# EasyEDA schematic SCH_Manip_2024-04-15.json
TITLE: Sheet_1; REV: 1.0; Date: 2024-04-04; Sheet: 1/1; Drawn By: tamir3; Company: Your Company
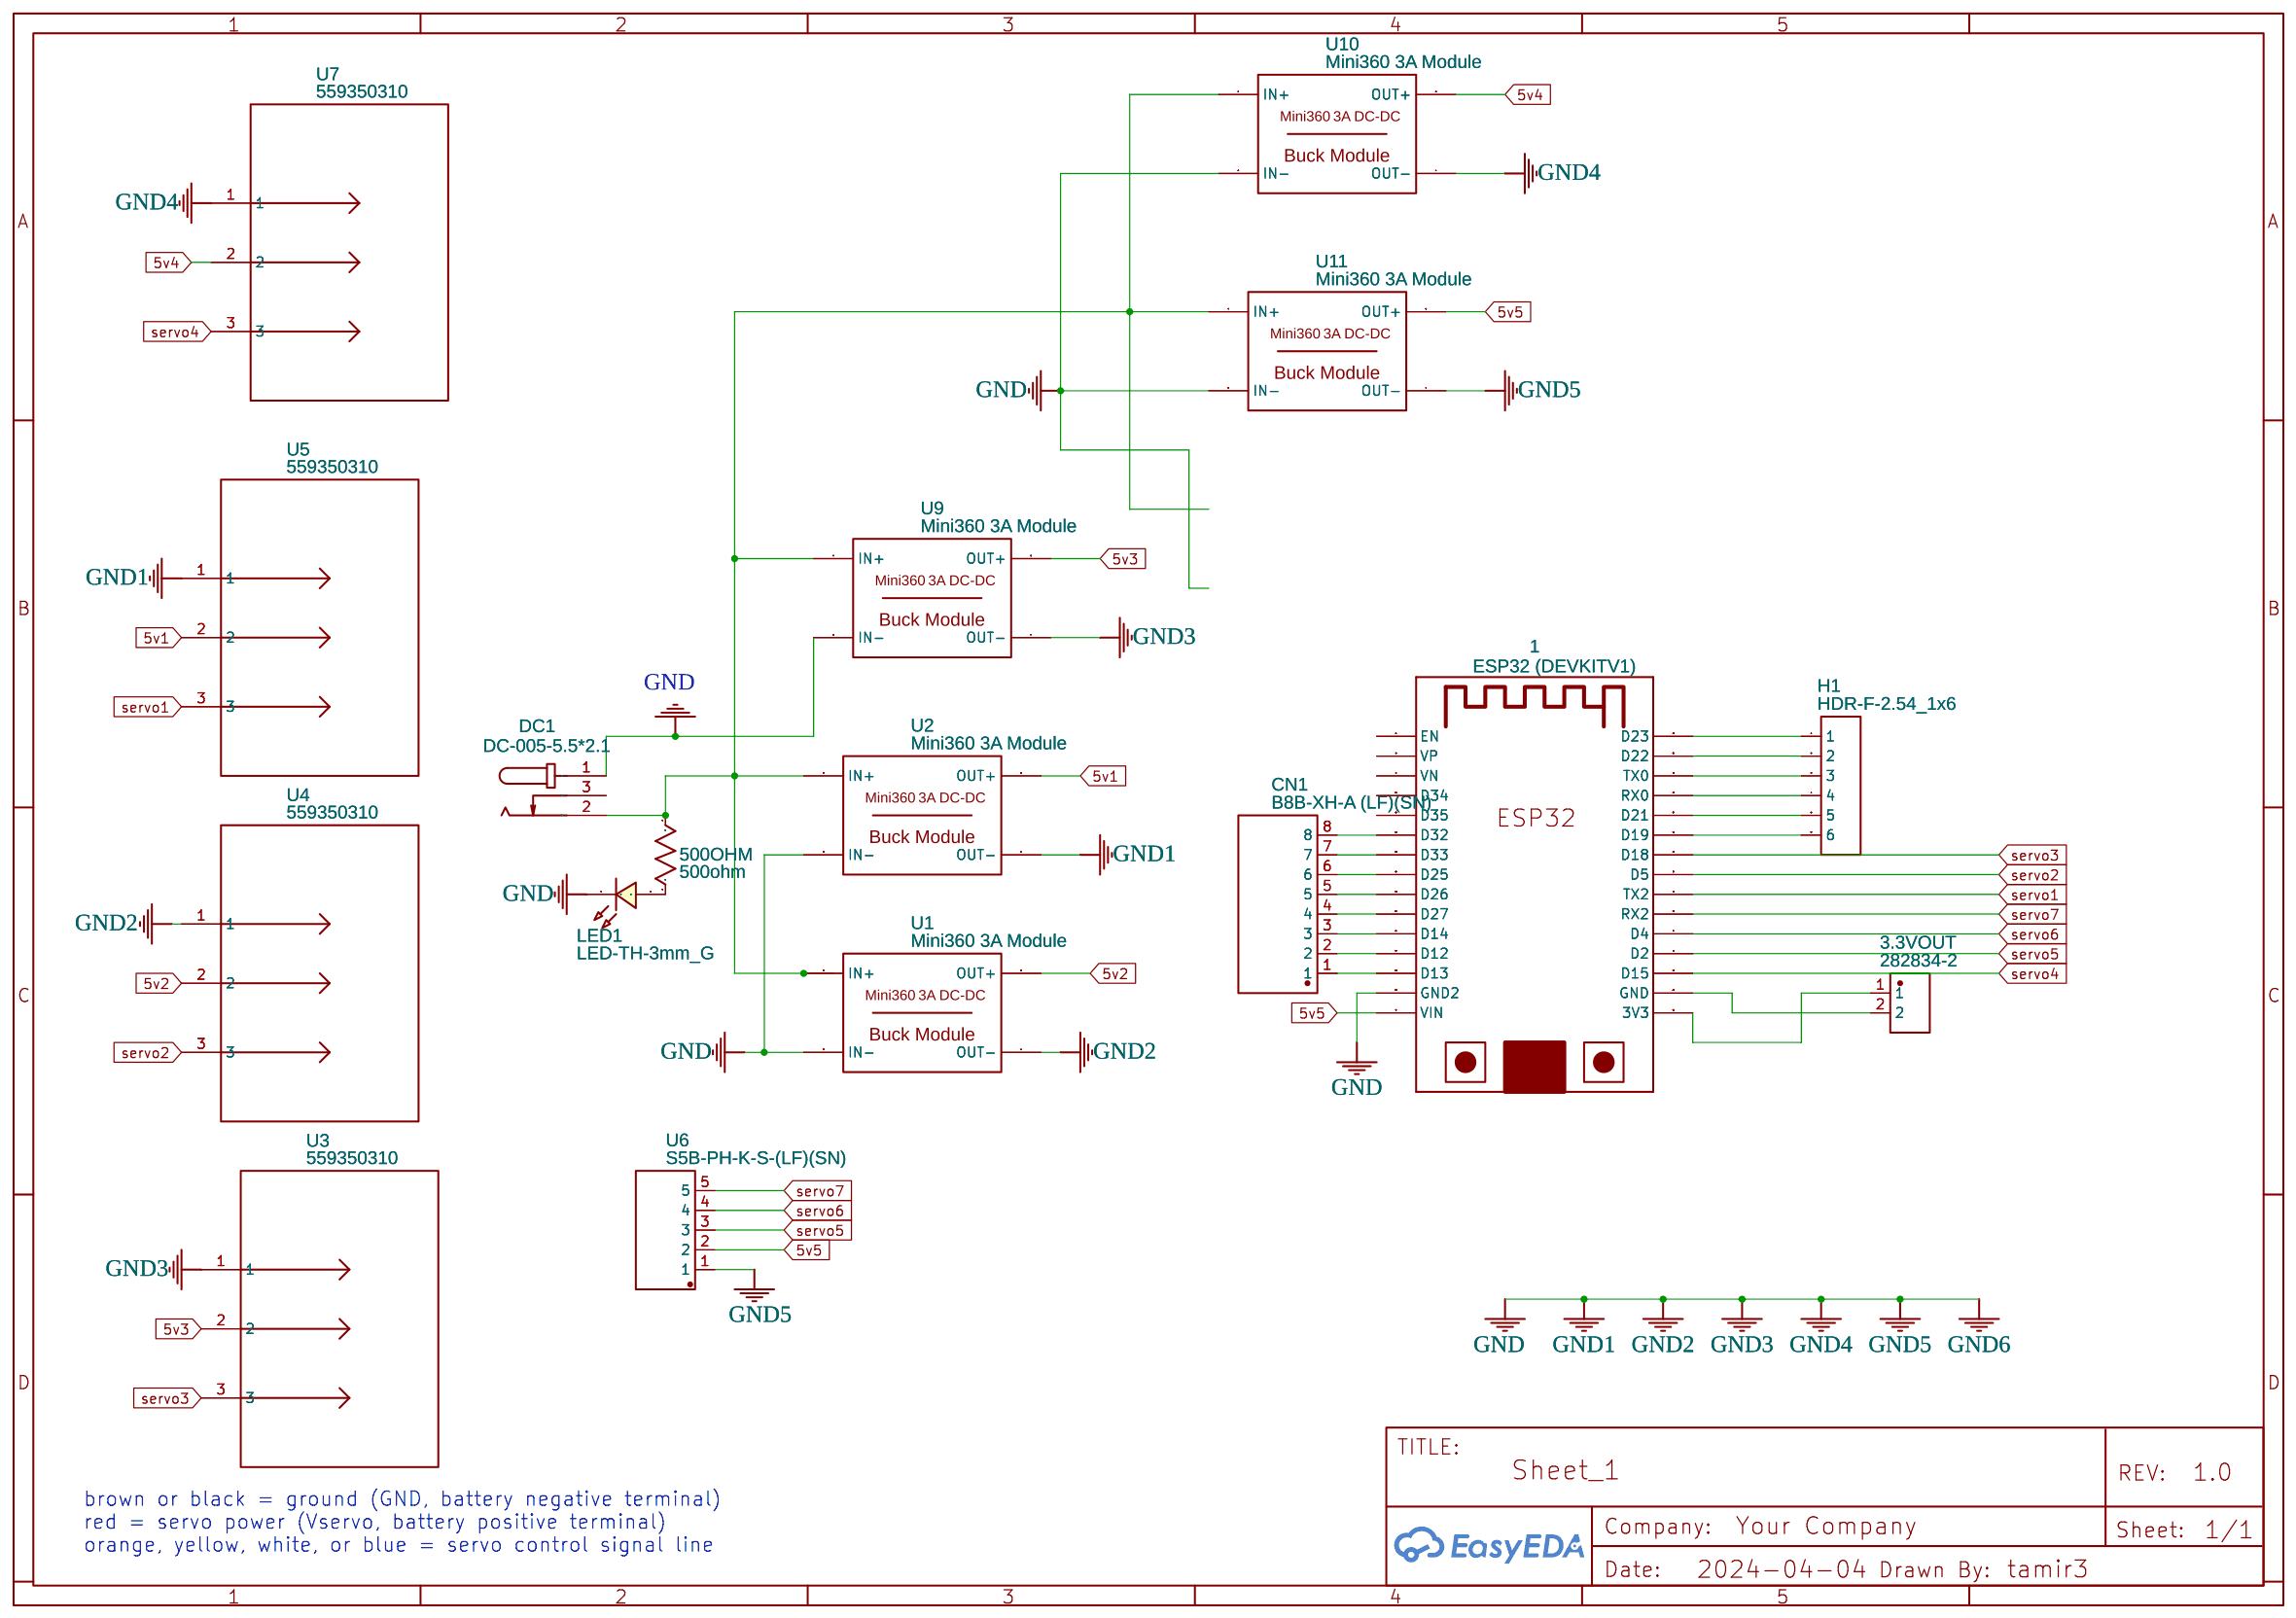
[diagram p0: schematic sheet]

## Parts
1  ESP32 (DEVKITV1)  [ESP32-DEVKITV1_ESP32-DEVKITV1]
3.3VOUT  282834-2  [CONN-TH_2P-P2.54_282834-2]
500OHM  500ohm  [R_AXIAL-0.6]
CN1  B8B-XH-A (LF)(SN)  [CONN-TH_B8B-XH-A-LF-SN]
DC1  DC-005-5.5*2.1  [DC-IN-TH_DC-005-2]
H1  HDR-F-2.54_1x6  [HDR-F-2.54_1X6]
LED1  LED-TH-3mm_G  [LED-TH_BD3.0_GREEN]
U1  Mini360 3A Module  [MINI360 BUCK CONVERTER]
U2  Mini360 3A Module  [MINI360 BUCK CONVERTER]
U3  559350310  [CONN-TH_559350310]
U4  559350310  [CONN-TH_559350310]
U5  559350310  [CONN-TH_559350310]
U6  S5B-PH-K-S-(LF)(SN)  [CONN-TH_S5B-PH-K-S-LF-SN]
U7  559350310  [CONN-TH_559350310]
U9  Mini360 3A Module  [MINI360 BUCK CONVERTER]
U10  Mini360 3A Module  [MINI360 BUCK CONVERTER]
U11  Mini360 3A Module  [MINI360 BUCK CONVERTER]

## Library data of the parts
1 = ESP32-DEVKIT-V1-30PIN: Contributor: rully.anggraini99
3.3VOUT = 282834-2: Contributor: lcsc; Supplier: LCSC; Supplier Part: C592983; Manufacturer: TE Connectivity(泰科电子); JLCPCB Part Class: Extended Part
500OHM = R_AXIAL-0.6_US: Contributor: LCEDA_Lib
CN1 = B8B-XH-A (LF)(SN): Contributor: LCSC; Supplier: LCSC; Supplier Part: C157972; Manufacturer: JST; Manufacturer Part: B8B-XH-A(LF)(SN); JLCPCB Part Class: Extended Part
DC1 = DC-005-5.5*2.1: Contributor: lcsc; Supplier: LCSC; Supplier Part: C9900017044; Manufacturer: null; JLCPCB Part Class: Extended Part
H1 = HDR-F-2.54_1x6: Supplier Part: C40877; Supplier: LCSC; Contributor: LCEDA_Lib
LED1 = LED-TH-3mm_G: Manufacturer: EVERLIGHT(台湾亿光); Manufacturer Part: 204-10SYGD/S530-E3; Supplier Part: C85161; Contributor: LCEDA_Lib
U1 U2 U9-U11 = Mini360 3A Module: Contributor: Joey Uson
U3-U5 U7 = 559350310: Contributor: LCSC; Supplier: LCSC; Supplier Part: C564109; Manufacturer: MOLEX; JLCPCB Part Class: Extended Part
U6 = S5B-PH-K-S-(LF)(SN): Contributor: LCSC; Supplier: LCSC; Supplier Part: C157923; Manufacturer: JST; Manufacturer Part: S5B-PH-K-S(LF)(SN); JLCPCB Part Class: Extended Part

## Nets
5v1: U2.3(OUT+) U5.2
5v2: U1.3(OUT+) U4.2
5v3: U3.2 U9.3(OUT+)
5v4: U7.2 U10.3(OUT+)
5v5: 1.VIN U6.2 U11.3(OUT+)
GND: 1.GND2 DC1.1 LED1.2 U1.2(IN-) U1.4(OUT-) U2.2(IN-) U2.4(OUT-) U3.1 U4.1 U5.1 U6.1 U7.1 U9.2(IN-) U9.4(OUT-) U10.2(IN-) U10.4(OUT-) U11.2(IN-) U11.4(OUT-)
servo1: 1.TX2 U5.3
servo2: 1.D5 U4.3
servo3: 1.D18 U3.3
servo4: 1.D15 U7.3
servo5: 1.D2 U6.3
servo6: 1.D4 U6.4
servo7: 1.RX2 U6.5
Net-(1-3V3): 1.3V3 3.3VOUT.1
Net-(1-D12): 1.D12 CN1.2
Net-(1-D13): 1.D13 CN1.1
Net-(1-D14): 1.D14 CN1.3
Net-(1-D19): 1.D19 H1.6
Net-(1-D21): 1.D21 H1.5
Net-(1-D22): 1.D22 H1.2
Net-(1-D23): 1.D23 H1.1
Net-(1-D25): 1.D25 CN1.6
Net-(1-D26): 1.D26 CN1.5
Net-(1-D27): 1.D27 CN1.4
Net-(1-D32): 1.D32 CN1.8
Net-(1-D33): 1.D33 CN1.7
Net-(1-GND): 1.GND 3.3VOUT.2
Net-(1-RX0): 1.RX0 H1.4
Net-(1-TX0): 1.TX0 H1.3
Net-(500OHM-1): 500OHM.1 LED1.1
Net-(500OHM-2): 500OHM.2 DC1.2 U1.1(IN+) U2.1(IN+) U9.1(IN+) U10.1(IN+) U11.1(IN+)

Not connected (* = marked no-connect by the designer): 1 D34 D35 EN VN VP; DC1 3

## Notes on the sheet
- brown or black = ground (GND, battery negative terminal)
  red = servo power (Vservo, battery positive terminal)
  orange, yellow, white, or blue = servo control signal line
